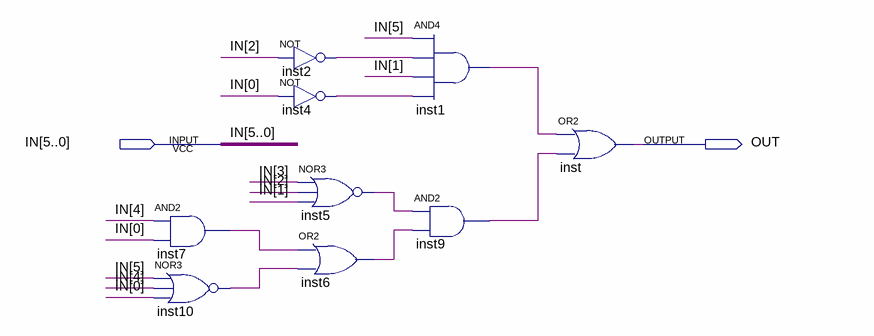
[diagram p0: schematic sheet]
// Quartus schematic Mod11.bdf as structural Verilog: 9 symbols, 2 pins
module Mod11 (
  input  [5:0] IN,
  output OUT
);

  wire inst1_out, inst2_out, inst4_out, inst5_out, inst6_out, inst7_out, inst9_out, inst10_out;

  and inst7 (inst7_out, IN[4], IN[0]);
  nor inst10 (inst10_out, IN[5], IN[4], IN[0]);
  not inst2 (inst2_out, IN[2]);
  not inst4 (inst4_out, IN[0]);
  nor inst5 (inst5_out, IN[3], IN[2], IN[1]);
  or inst6 (inst6_out, inst7_out, inst10_out);
  and inst1 (inst1_out, IN[5], inst2_out, IN[1], inst4_out);
  and inst9 (inst9_out, inst5_out, inst6_out);
  or inst (OUT, inst1_out, inst9_out);
endmodule
